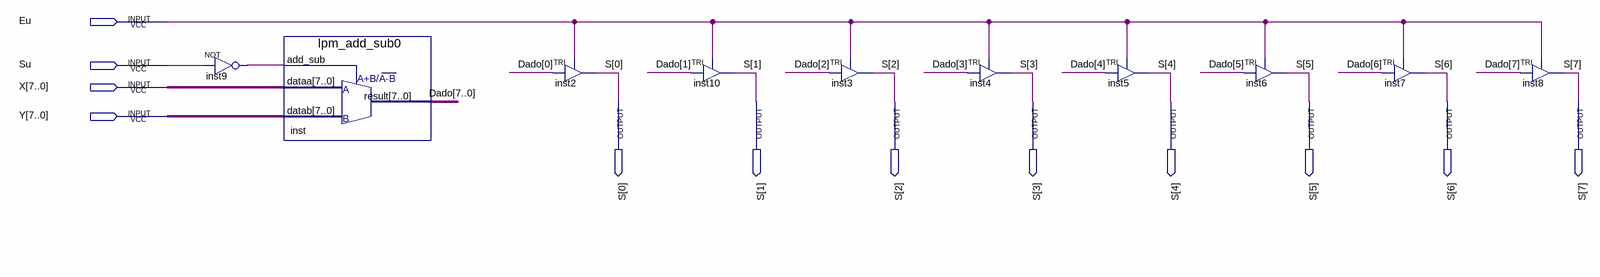
[diagram p0: schematic sheet]
// Quartus schematic Somador-Subtrador.bdf as structural Verilog: 10 symbols, 12 pins
module \Somador-Subtrador  (
  input  Eu,
  input  Su,
  input  [7:0] X,
  input  [7:0] Y,
  output [7:0] S
);

  wire inst9_out;
  wire [7:0] Dado;

  not inst9 (inst9_out, Su);
  lpm_add_sub0 inst (.add_sub(inst9_out), .dataa(X), .datab(Y), .result(Dado));
  TRI inst2 (.IN(Dado[0]), .OE(Eu), .OUT(S[0]));
  TRI inst10 (.IN(Dado[1]), .OE(Eu), .OUT(S[1]));
  TRI inst3 (.IN(Dado[2]), .OE(Eu), .OUT(S[2]));
  TRI inst4 (.IN(Dado[3]), .OE(Eu), .OUT(S[3]));
  TRI inst5 (.IN(Dado[4]), .OE(Eu), .OUT(S[4]));
  TRI inst6 (.IN(Dado[5]), .OE(Eu), .OUT(S[5]));
  TRI inst7 (.IN(Dado[6]), .OE(Eu), .OUT(S[6]));
  TRI inst8 (.IN(Dado[7]), .OE(Eu), .OUT(S[7]));
endmodule
